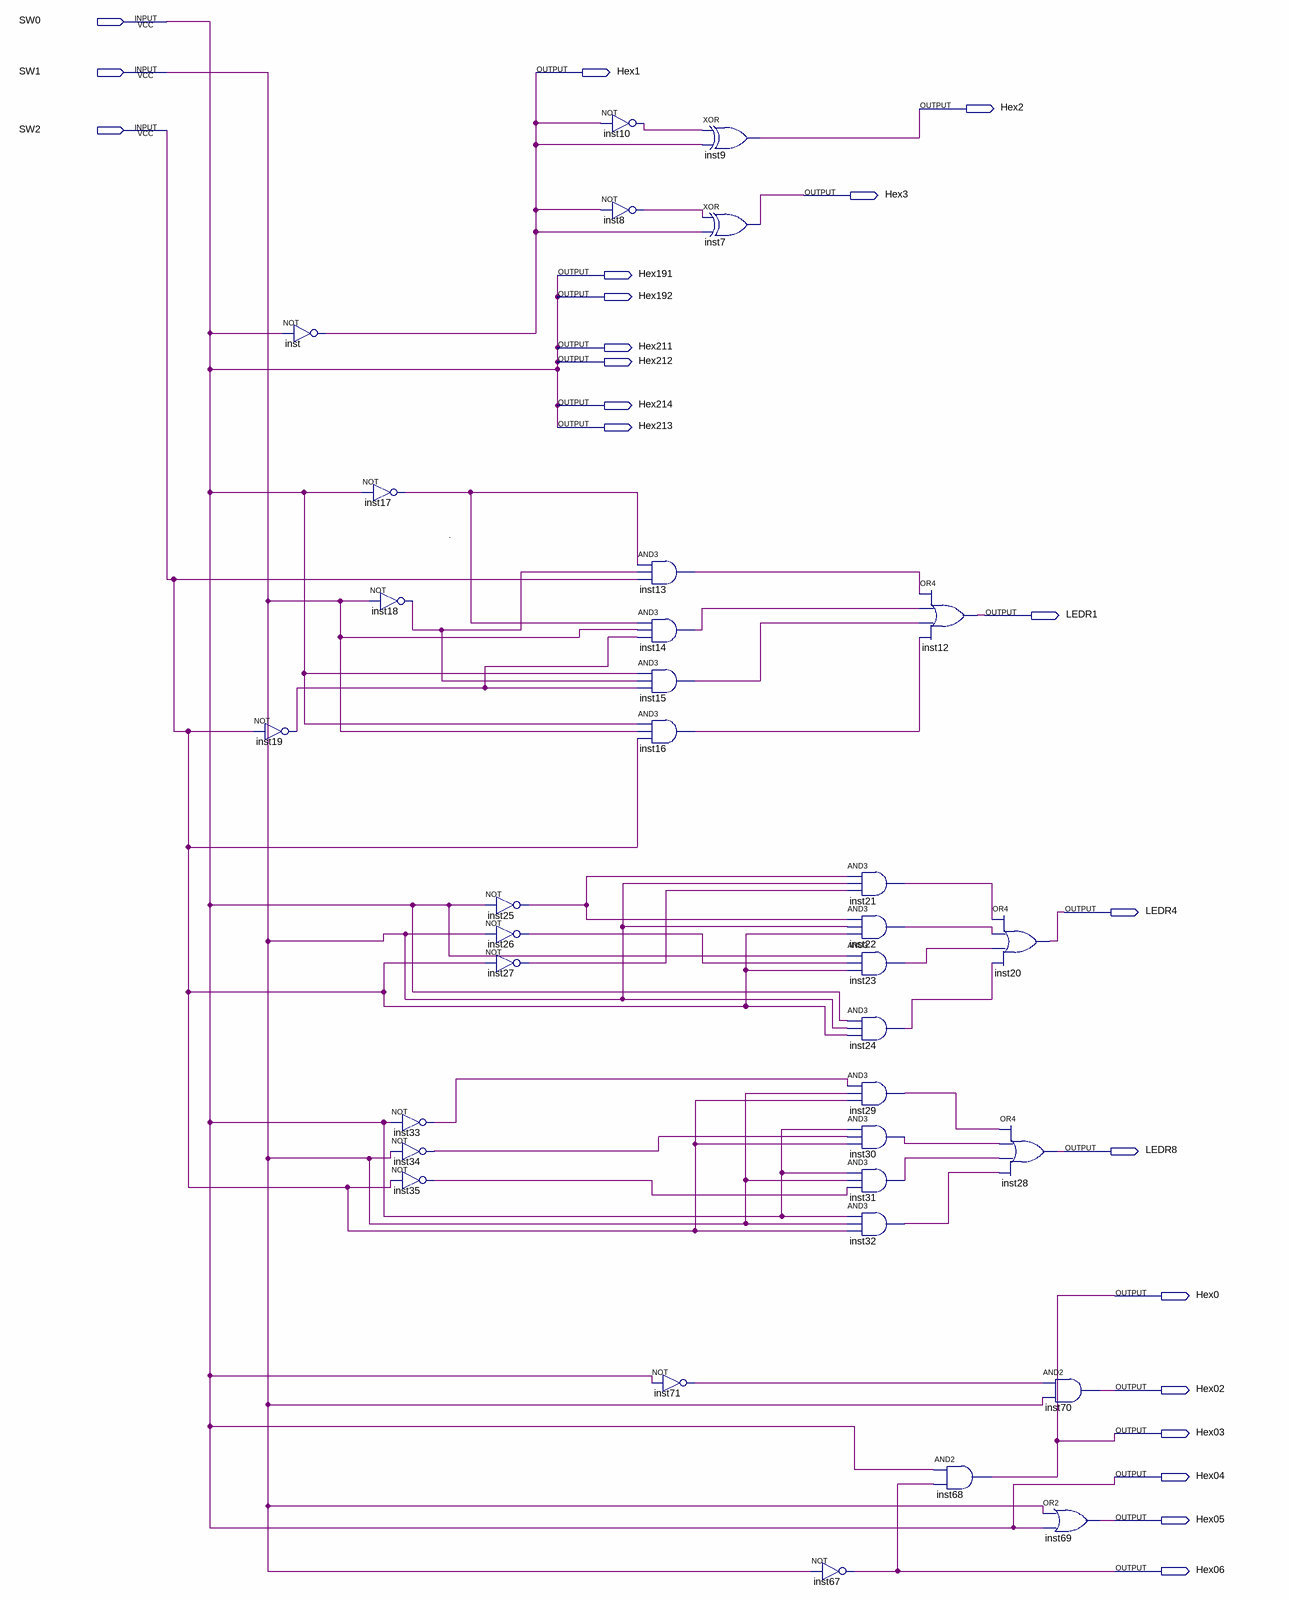
[diagram p0: schematic sheet]
// Quartus schematic L1C019.bdf as structural Verilog: 34 symbols, 21 pins
module L1C019 (
  input  SW0,
  input  SW1,
  input  SW2,
  output Hex1,
  output Hex2,
  output Hex3,
  output Hex191,
  output Hex192,
  output Hex211,
  output Hex212,
  output Hex214,
  output Hex213,
  output LEDR1,
  output LEDR4,
  output LEDR8,
  output Hex0,
  output Hex02,
  output Hex03,
  output Hex04,
  output Hex05,
  output Hex06
);

  wire inst8_out, inst10_out, inst13_out, inst14_out, inst15_out, inst16_out, inst17_out, inst18_out,
       inst19_out, inst21_out, inst22_out, inst23_out, inst24_out, inst25_out, inst26_out, inst27_out,
       inst29_out, inst30_out, inst31_out, inst32_out, inst33_out, inst34_out, inst35_out, inst71_out;

  not inst (Hex1, SW0);
  not inst19 (inst19_out, SW2);
  not inst17 (inst17_out, SW0);
  not inst18 (inst18_out, SW1);
  not inst33 (inst33_out, SW0);
  not inst34 (inst34_out, SW1);
  not inst35 (inst35_out, SW2);
  not inst25 (inst25_out, SW0);
  not inst26 (inst26_out, SW1);
  not inst27 (inst27_out, SW2);
  not inst10 (inst10_out, Hex1);
  not inst8 (inst8_out, Hex1);
  and inst13 (inst13_out, inst17_out, inst18_out, SW2);
  and inst14 (inst14_out, inst17_out, SW1, inst19_out);
  and inst15 (inst15_out, SW0, inst18_out, inst19_out);
  and inst16 (inst16_out, SW0, SW1, SW2);
  not inst71 (inst71_out, SW0);
  xor inst9 (Hex2, inst10_out, Hex1);
  xor inst7 (Hex3, inst8_out, Hex1);
  not inst67 (Hex06, SW1);
  and inst21 (inst21_out, inst25_out, SW1, inst27_out);
  and inst22 (inst22_out, inst25_out, SW1, SW2);
  and inst23 (inst23_out, SW0, inst26_out, SW2);
  and inst24 (inst24_out, SW0, SW1, SW2);
  and inst29 (inst29_out, inst33_out, SW1, SW2);
  and inst30 (inst30_out, SW0, inst34_out, SW2);
  and inst31 (inst31_out, SW0, SW1, inst35_out);
  and inst32 (inst32_out, SW0, SW1, SW2);
  or inst12 (LEDR1, inst13_out, inst14_out, inst15_out, inst16_out);
  and inst68 (Hex0, SW0, Hex06);
  or inst20 (LEDR4, inst21_out, inst22_out, inst23_out, inst24_out);
  or inst28 (LEDR8, inst29_out, inst30_out, inst31_out, inst32_out);
  and inst70 (Hex02, inst71_out, SW1);
  or inst69 (Hex05, SW1, SW0);

  assign Hex03 = Hex0;
  assign Hex04 = SW0;
  assign Hex191 = SW0;
  assign Hex192 = SW0;
  assign Hex211 = SW0;
  assign Hex212 = SW0;
  assign Hex213 = SW0;
  assign Hex214 = SW0;

  // Notes on the sheet:
  //   .
endmodule
